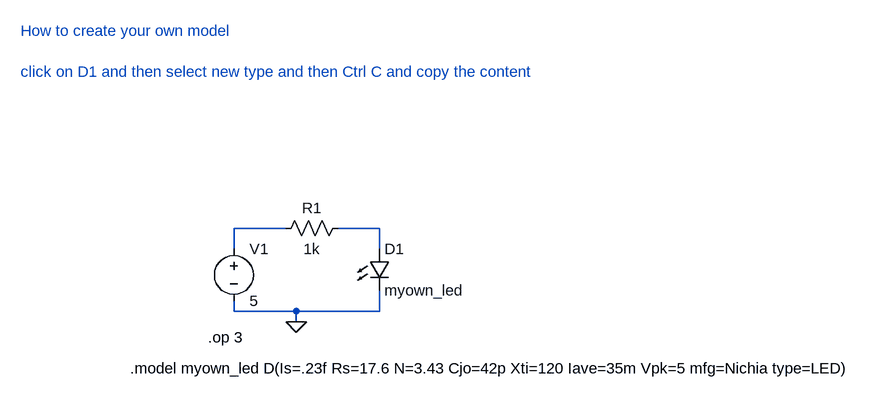
[diagram p0: schematic basic.asc]
basic.asc, the LTspice schematic file:
Version 4
SHEET 1 1176 680
WIRE 128 80 48 80
WIRE 272 80 208 80
WIRE 48 112 48 80
WIRE 272 112 272 80
WIRE 48 208 48 192
WIRE 144 208 48 208
WIRE 272 208 272 176
WIRE 272 208 144 208
WIRE 144 224 144 208
FLAG 144 224 0
DATAFLAG 80 80 ""
DATAFLAG 224 80 "V(n001)-V(n002)"
SYMBOL voltage 48 96 R0
SYMATTR InstName V1
SYMATTR Value 5
SYMBOL res 224 64 R90
WINDOW 0 0 56 VBottom 2
WINDOW 3 32 56 VTop 2
SYMATTR InstName R1
SYMATTR Value 1k
SYMBOL LED 256 112 R0
SYMATTR InstName D1
SYMATTR Value myown_led
TEXT 8 248 Left 2 !.op 3
TEXT -112 296 Left 2 !.model myown_led D(Is=.23f Rs=17.6 N=3.43 Cjo=42p Xti=120 Iave=35m Vpk=5 mfg=Nichia type=LED)
TEXT -280 -224 Left 2 ;How to create your own model\n \nclick on D1 and then select new type and then Ctrl C and copy the content

The netlist it stands for:
* basic.asc
V1 N001 0 5
R1 N002 N001 1k
D1 N002 0 myown_led
.model D D
.lib standard.dio
.op 3
.model myown_led D(Is=.23f Rs=17.6 N=3.43 Cjo=42p Xti=120 Iave=35m Vpk=5 mfg=Nichia type=LED)
* How to create your own model
* click on D1 and then select new type and then Ctrl C and copy the content
.backanno
.end